# EAGLE design ESP_SCH (EAGLE 9.6.2)
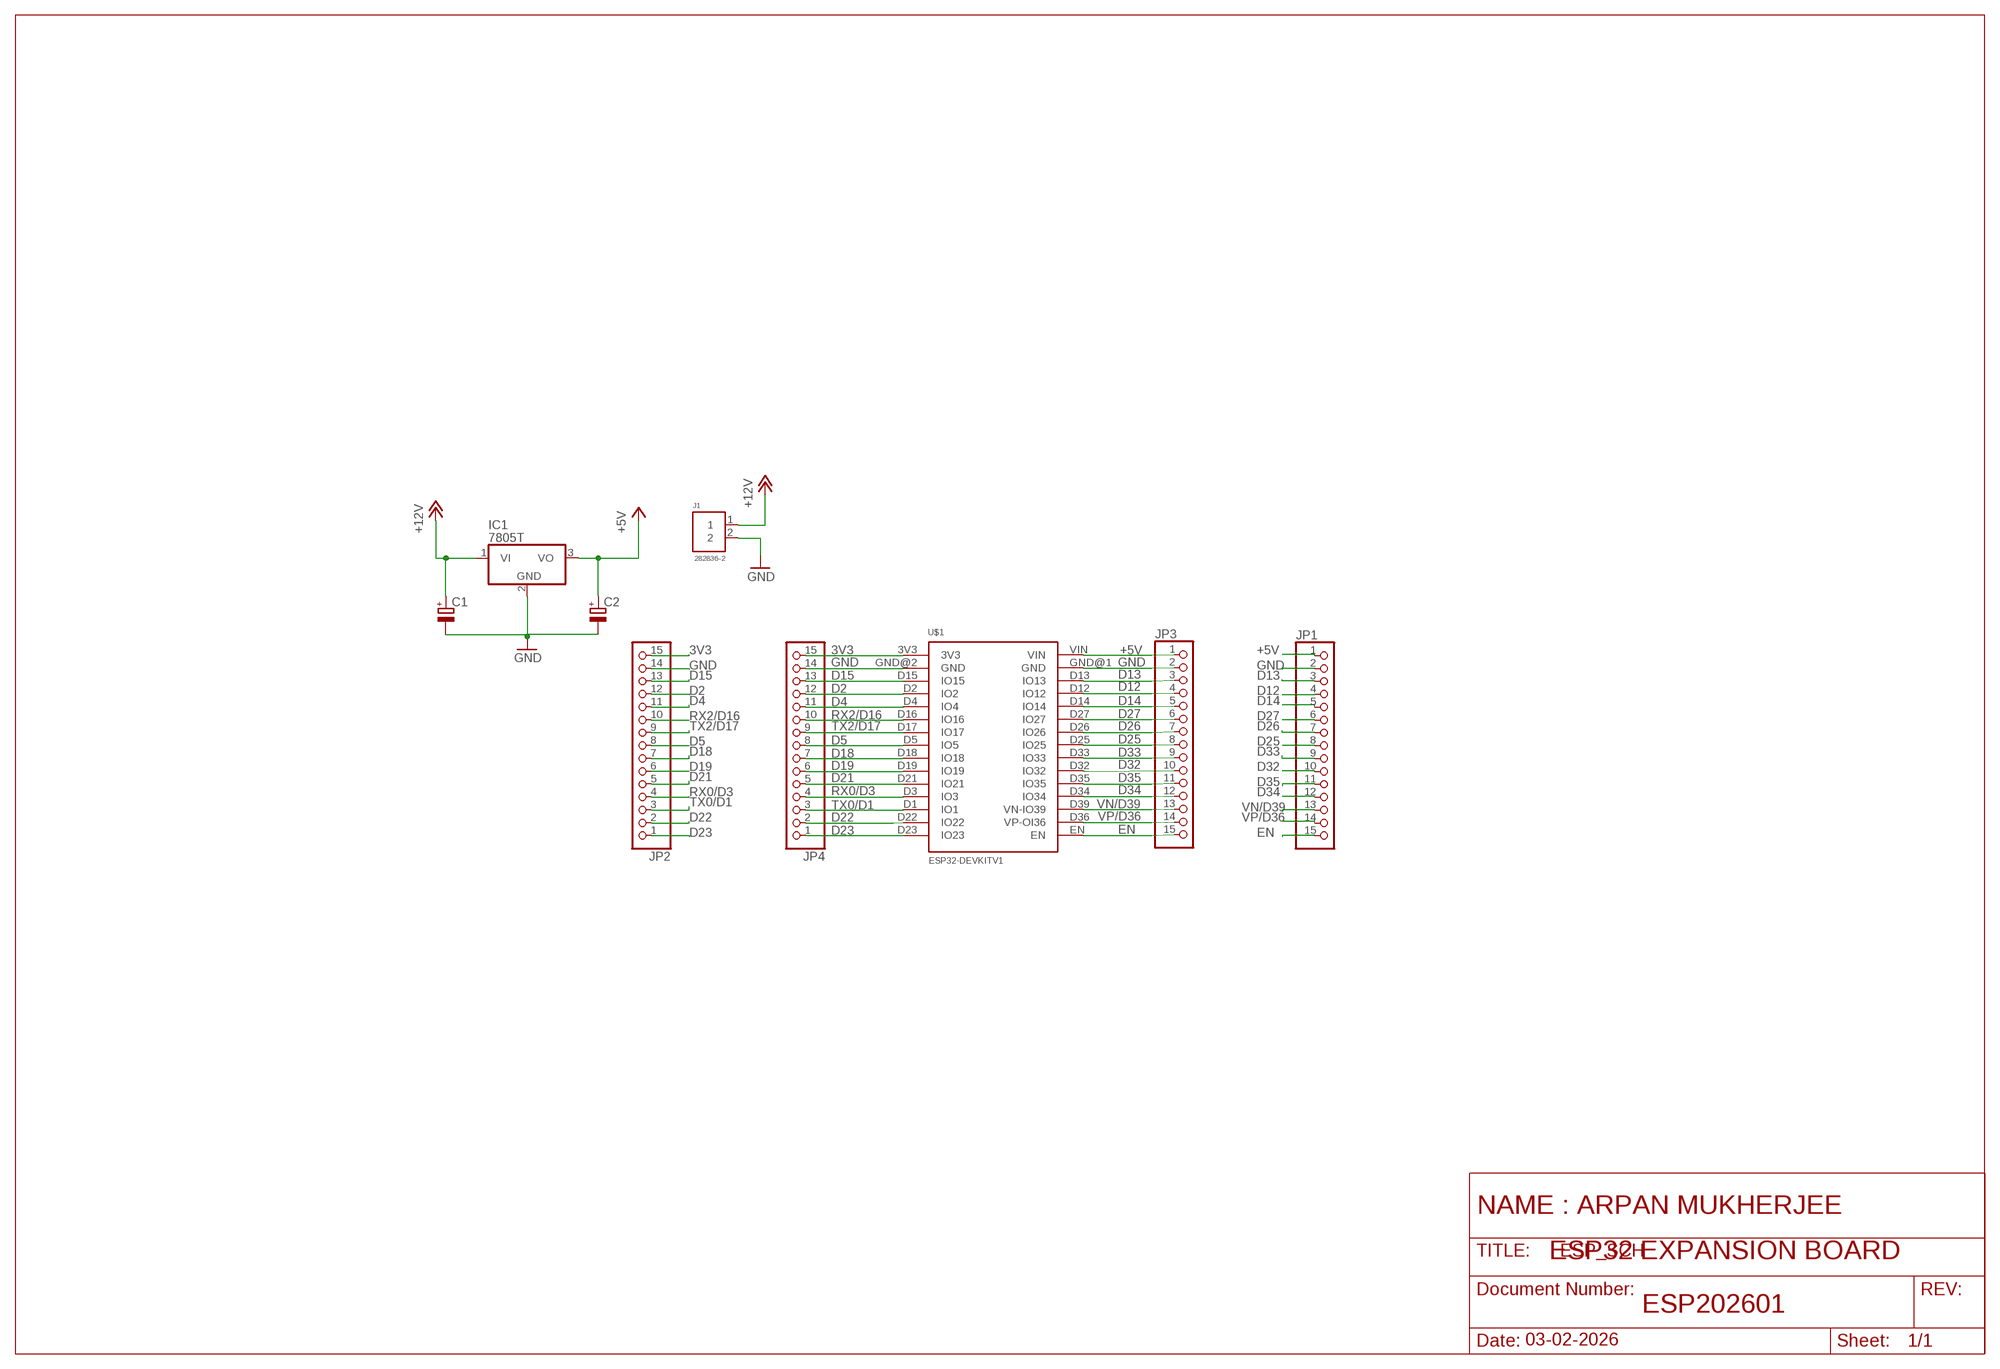
[diagram p0: schematic, sheet 1]

## Parts
C1  CPOL-EUE2.5-5  [E2,5-5]
C2  CPOL-EUE2.5-5  [E2,5-5]
IC1  7805T  [TO220H]
J1  282836-2  [CONN_282836-2]
JP1  PINHD-1X15  [1X15]
JP2  PINHD-1X15  [1X15]
JP3  PINHD-1X15  [1X15]
JP4  PINHD-1X15  [1X15]
U$1  ESP32DEVKITV1  [ESP32-DEVKITV1]

## Nets
3V3: JP2.15 JP4.15 U$1.3V3
+5V: C2.+ IC1.3(VO) JP1.1 JP3.1 U$1.VIN
+12V: C1.+ IC1.1(VI) J1.1
D2: JP2.12 JP4.12 U$1.D2(IO2)
D4: JP2.11 JP4.11 U$1.D4(IO4)
D5: JP2.8 JP4.8 U$1.D5(IO5)
D12: JP1.4 JP3.4 U$1.D12(IO12)
D13: JP1.3 JP3.3 U$1.D13(IO13)
D14: JP1.5 JP3.5 U$1.D14(IO14)
D15: JP2.13 JP4.13 U$1.D15(IO15)
D18: JP2.7 JP4.7 U$1.D18(IO18)
D19: JP2.6 JP4.6 U$1.D19(IO19)
D21: JP2.5 JP4.5 U$1.D21(IO21)
D22: JP2.2 JP4.2 U$1.D22(IO22)
D23: JP2.1 JP4.1 U$1.D23(IO23)
D25: JP1.8 JP3.8 U$1.D25(IO25)
D26: JP1.7 JP3.7 U$1.D26(IO26)
D27: JP1.6 JP3.6 U$1.D27(IO27)
D32: JP1.10 JP3.10 U$1.D32(IO32)
D33: JP1.9 JP3.9 U$1.D33(IO33)
D34: JP1.12 JP3.12 U$1.D34(IO34)
D35: JP1.11 JP3.11 U$1.D35(IO35)
EN: JP1.15 JP3.15 U$1.EN
GND: C1.- C2.- IC1.2(GND) J1.2 JP1.2 JP2.14 JP3.2 JP4.14 U$1.GND@1(GND) U$1.GND@2(GND)
RX0/D3: JP2.4 JP4.4 U$1.D3(IO3)
RX2/D16: JP2.10 JP4.10 U$1.D16(IO16)
TX0/D1: JP2.3 JP4.3 U$1.D1(IO1)
TX2/D17: JP2.9 JP4.9 U$1.D17(IO17)
VN/D39: JP1.13 JP3.13 U$1.D39(VN-IO39)
VP/D36: JP1.14 JP3.14 U$1.D36(VP-OI36)

## Notes on the sheet
- NAME : ARPAN MUKHERJEE
- ESP32 EXPANSION BOARD
- ESP202601
- 03-02-2026

## Library data of the parts
C1 C2 = rcl:CPOL-EU: POLARIZED CAPACITOR, European symbol; SPICEPREFIX: C
IC1 = linear 2:78*: Positive VOLTAGE REGULATOR Source: http://cache.national.com/ds/LM/LM78L05.pdf http://www.fairchildsemi.com/ds/LM/LM7805.pdf
J1 = PC_Con_ScrewTerminal_2P_5mm:282836-2: TERM BLOCK 2POS SIDE ENTRY 5MM Check availability <https://pricing.snapeda.com/parts/282836-2/TE%20Connectivity/view-part?ref=eda>; AVAILABILITY: In Stock; COMMENT: 282836-2; DESCRIPTION: Connector, Terminal Block; Wire Receptacle; 2 Pos.; 16-30 AWG; 0.197 in. CL; Sid; MF: TE Connectivity; MP: 282836-2; PACKAGE: None; PRICE: None; PURCHASE-URL: https://pricing.snapeda.com/search/part/282836-2/?ref=eda
JP1-JP4 = pinhead:PINHD-1X15: PIN HEADER
U$1 = ESP32-DEVKITV1:ESP32DEVKITV1

## Board
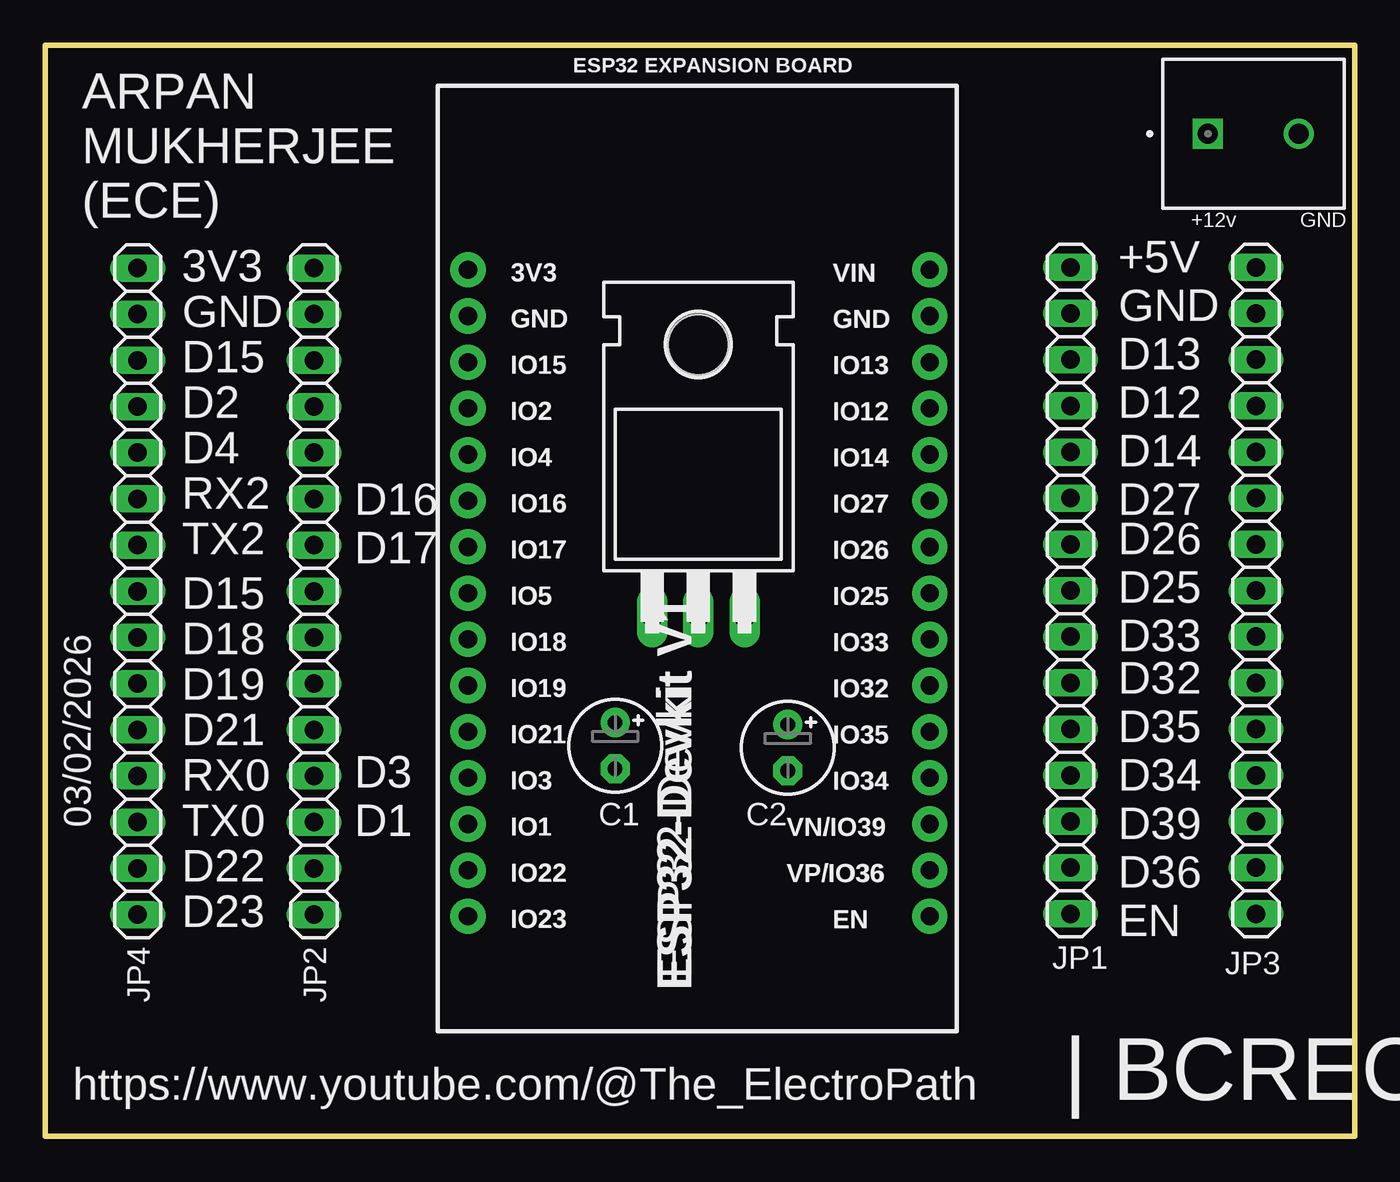
[diagram p1: board, top side]
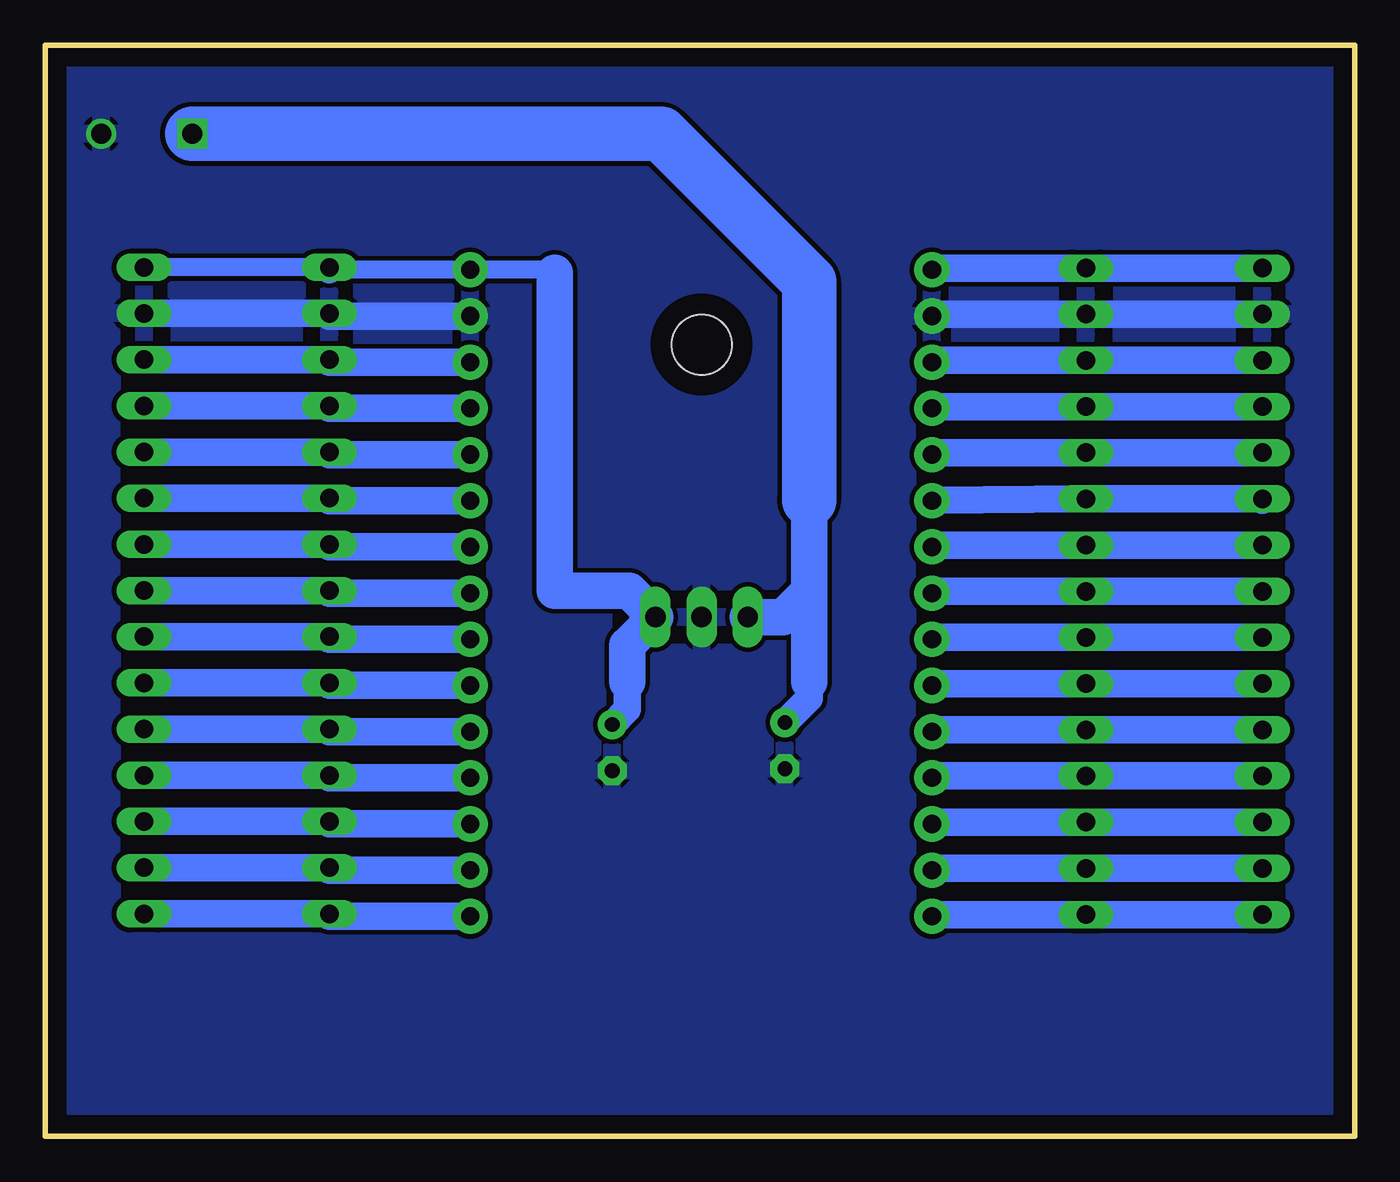
[diagram p2: board, bottom side, seen from below]

Size 72 x 60 mm. Coordinates in mm from the lower left corner, seen from the top.
Outline: 0,0 72,0 72,60 0,60 0,0
Copper layers (1*16): Top 0.035mm / dielectric 1.5mm / Bottom 0.035mm
Design rules "default": minimum track width 6mil, minimum drill 0.35mm, track to track 6mil, track to pad 6mil, pad to pad 6mil, via to via 6mil, smd to smd 6mil, copper to edge 40mil, drill to drill 6mil, minimum pad ring 10mil, minimum via ring 8mil, stop-mask expansion 4mil, vias tented up to drill 0mil, thermal gap 10mil

### Footprints (pad centres in the part's own frame; a part is rotated, then mirrored left to right if it is on the bottom)
E2,5-5 = drill 0.813 pad 1.6: + -1.27,0 | drill 0.813 pad 1.6 octagon: - 1.27,0
TO220H = drill 1.118 long: 1 -2.54,-10.16; 2 0,-10.16; 3 2.54,-10.16 | hole 3.302: 0,4.826
CONN_282836-2 = drill 1.1 square: 1 -2.5,0 | drill 1.1: 2 2.5,0
1X15 = drill 1.016 long: 1 -17.78,0; 2 -15.24,0; 3 -12.7,0; 4 -10.16,0; 5 -7.62,0; 6 -5.08,0; 7 -2.54,0; 8 0,0; 9 2.54,0; 10 5.08,0; 11 7.62,0; 12 10.16,0; 13 12.7,0; 14 15.24,0; 15 17.78,0
ESP32-DEVKITV1 = drill 1 pad 1.93: 3V3 -16.52,-12.27; D1 13.96,-12.27; D2 -8.9,-12.27; D3 11.42,-12.27; D4 -6.36,-12.27; D5 1.26,-12.27; D12 -8.9,13.135; D13 -11.44,13.135; D14 -6.36,13.135; D15 -11.44,-12.27; D16 -3.82,-12.27; D17 -1.28,-12.27; D18 3.8,-12.27; D19 6.34,-12.27; D21 8.88,-12.27; D22 16.5,-12.27; D23 19.04,-12.27; D25 1.26,13.135; D26 -1.28,13.135; D27 -3.82,13.135; D32 6.34,13.135; D33 3.8,13.135; D34 11.42,13.135; D35 8.88,13.135; D36 16.5,13.135; D39 13.96,13.135; EN 19.04,13.135; GND@1 -13.98,13.135; GND@2 -13.98,-12.27; VIN -16.52,13.135

### Placement (x,y rotation side)
C1  31.33,21.49 270 top
C2  40.83,21.38 270 top
IC1  35.91,38.72 0 top
J1  66.44,55.14 0 top
JP1  56.38,30.02 270 top
JP2  14.77,29.98 90 top
JP3  66.58,30.02 270 top
JP4  5.07,29.98 90 top
U$1  35.51,31.14 270 top

### Tracks (layer width: path | path; a pad name or v marks a point on that pad's centre or on a via)
3V3
  Bottom 1.5: JP4.15 JP2.15 23.24,47.76 U$1.3V3
+5V
  Bottom 1: 44,47.5 44,47.66 U$1.VIN 56.38,47.66 | JP1.1 JP3.1
  Bottom 1.5: 40,25 40,23.48 C2.+ | 56.38,47.66 JP1.1
  Bottom 2: 40,25 40,27.01 IC1.3 39.89,30 44,30 44,47.5
+12V
  Bottom 1.5: 30,25 30,24.09 C1.+
  Bottom 2: 30,35 30,30 | 30,30 31.44,28.56 IC1.1 | 30,30 30,25
  Bottom 3: J1.1 38.14,55.14 30,47 30,35
D2
  Bottom 1.5: JP4.12 JP2.12 23.24,40.14 U$1.D2
D4
  Bottom 1.5: JP4.11 JP2.11 23.24,37.6 U$1.D4
D5
  Bottom 1.5: JP4.8 JP2.8 23.24,29.98 U$1.D5
D12
  Bottom 1.5: U$1.D12 56.38,40.04 JP1.4 JP3.4
D13
  Bottom 1.5: U$1.D13 56.38,42.58 JP1.3 JP3.3
D14
  Bottom 1.5: U$1.D14 56.38,37.5 JP1.5 JP3.5
D15
  Bottom 1.5: JP4.13 JP2.13 23.24,42.68 U$1.D15
D18
  Bottom 1.5: JP4.7 JP2.7 23.24,27.44 U$1.D18
D19
  Bottom 1.5: JP4.6 JP2.6 23.24,24.9 U$1.D19
D21
  Bottom 1.5: JP4.5 JP2.5 23.24,22.36 U$1.D21
D22
  Bottom 1.5: JP4.2 JP2.2 23.24,14.74 U$1.D22
D23
  Bottom 1.5: JP4.1 JP2.1 23.24,12.2 U$1.D23
D25
  Bottom 1.5: U$1.D25 56.38,29.88 JP1.8 JP3.8
D26
  Bottom 1.5: U$1.D26 56.38,32.42 JP1.7 JP3.7
D27
  Bottom 1.5: U$1.D27 56.38,34.96 JP1.6 JP3.6
D32
  Bottom 1.5: U$1.D32 56.38,24.8 JP1.10 JP3.10
D33
  Bottom 1.5: U$1.D33 56.38,27.34 JP1.9 JP3.9
D34
  Bottom 1.5: U$1.D34 56.38,19.72 JP1.12 JP3.12
D35
  Bottom 1.5: U$1.D35 56.38,22.26 JP1.11 JP3.11
EN
  Bottom 1.5: U$1.EN 56.38,12.1 JP1.15 JP3.15
GND
  Bottom 1.5: JP4.14 JP2.14 23.24,45.22 U$1.GND@2 | U$1.GND@1 56.38,45.12 JP1.2 JP3.2
  pour Bottom (isolate 0.254): 0,0 72,0 72,60 0,60
N$1
  Top 0.001: 0,0 72,0 72,60 0,60 0,0
RX0/D3
  Bottom 1.5: JP4.4 JP2.4 23.24,19.82 U$1.D3
RX2/D16
  Bottom 1.5: 5.07,35 JP4.10 JP2.10 23.24,35 U$1.D16
TX0/D1
  Bottom 1.5: JP4.3 JP2.3 23.24,17.28 U$1.D1
TX2/D17
  Bottom 1.5: U$1.D17 23.24,32.52 JP2.9 JP4.9
VN/D39
  Bottom 1.5: U$1.D39 56.38,17.18 JP1.13 JP3.13
VP/D36
  Bottom 1.5: U$1.D36 56.38,14.64 JP1.14 JP3.14

### Text on the board
tPlace: ESP32 EXPANSION BOARD | ARPAN / MUKHERJEE / (ECE) | +12v | GND | 03/02/2026 | | BCREC
tNames: 3V3 | GND | D15 | D2 | D4 | RX2 | TX2 | D16 / D17 | +5V / GND / D13 / D12 / D14 / D27 | D15 | D18 | D19 | D26 / D25 / D33 | D21 | RX0 | TX0 | D3 / D1 | D22 | D23 | D32 / D35 / D34 / D39 / D36 / EN | https://www.youtube.com/@The_ElectroPath
_tplace: 3V3 | VIN | GND | GND | IO15 | IO13 | IO2 | IO12 | IO4 | IO14 | IO16 | IO27 | IO17 | IO26 | ESP32-Devkit V1 | IO5 | IO25 | IO18 | IO33 | IO19 | IO32 | IO21 | IO35 | IO3 | IO34 | IO1 | VN/IO39 | IO22 | VP/IO36 | IO23 | EN
200bmp: C:/Users/arpan/Downloads/BCREC.bmp